# EAGLE design Tomo SMT (EAGLE 6.2)
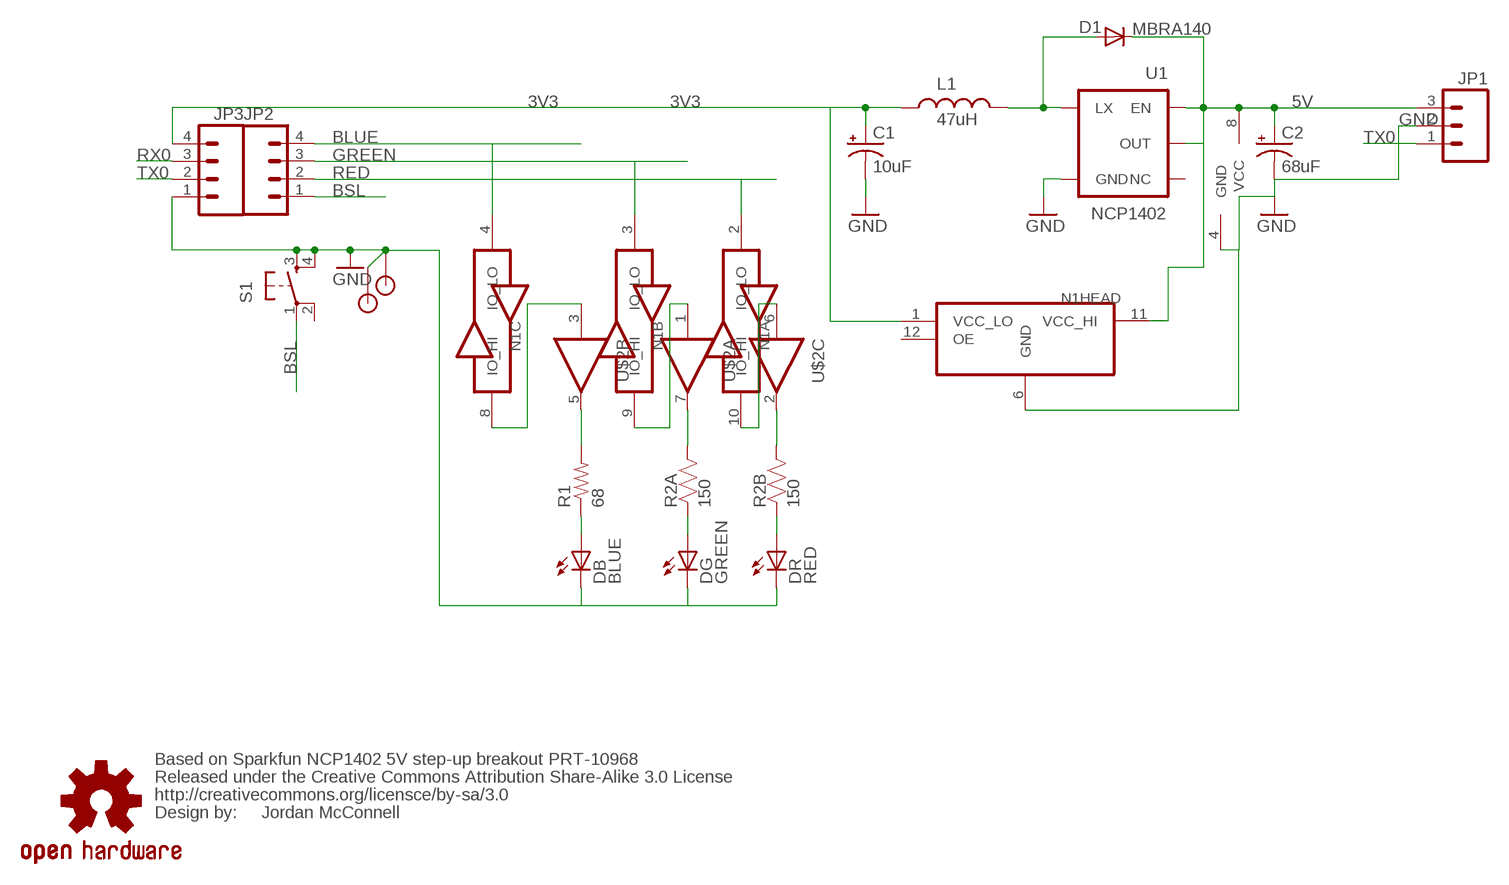
[diagram p0: schematic, sheet 1]

## Parts
C1  10uF  CAP_POL1206  [EIA3216]
C2  68uF  CAP_POL3528  [EIA3528]
D1  MBRA140  DIODESMA  [SMA-DIODE]
DB  BLUE  LED5MM  [LED5MM]
DG  GREEN  LED5MM  [LED5MM]
DR  RED  LED5MM  [LED5MM]
JP1  M03PTH  [1X03]
JP2  M04PTH  [1X04]
JP3  M04PTH  [1X04]
L1  47uH  INDUCTORRCH-895  [RADIAL_5MM]
N1  TXB0104RUT  [R-PUQFN-N12]
R1  68  RESISTOR0402-RES  [0402-RES]
R2  150  RP2EXB24V  [CRA02]
S1  TAC_SWITCHPTH  [TACTILE-PTH]
U1  NCP1402  V_REG_NCP1400SOT23-5  [SOT23-5]
U$1  OSHW-LOGOL  [OSHW-LOGO-L]
U$2  743G34  [DCT]
U$3  STANDOFF  [STANDOFF]
U$4  STANDOFF  [STANDOFF]

## Nets
3V3: C1.A(+) JP3.4 L1.1 N1.1(HEAD:VCC_LO)
5V: C2.A(+) D1.C JP1.3 N1.11(HEAD:VCC_HI) U1.1(EN) U1.2(OUT) U$2.8(VCC)
BLUE: JP2.4 N1.4(C:IO_LO)
BSL: JP2.1 S1.1
GND: C1.C(-) C2.C(-) DB.K(C) DG.K(C) DR.K(C) JP1.2 JP3.1 N1.6(HEAD:GND) S1.3 S1.4 U1.4(GND) U$2.4(GND) U$3.P$1 U$4.P$1
GREEN: JP2.3 N1.3(B:IO_LO)
N$1: R1.2 U$2.5(B:OUT)
N$2: DB.A R1.1
N$3: D1.A L1.2 U1.5(LX)
N$4: DG.A R2.1
N$5: R2.4 U$2.7(A:OUT)
N$6: R2.3 U$2.2(C:OUT)
N$7: DR.A R2.2
N$8: N1.8(C:IO_HI) U$2.3(B:IN)
N$9: N1.9(B:IO_HI) U$2.1(A:IN)
N$10: N1.10(A:IO_HI) U$2.6(C:IN)
RED: JP2.2 N1.2(A:IO_LO)
RX0: JP3.3
TX0: JP1.1 JP3.2
Unconnected: N1.5(D:IO_LO) N1.7(D:IO_HI) N1.12(HEAD:OE) S1.2 U1.3(NC)

## Notes on the sheet
- Based on Sparkfun NCP1402 5V step-up breakout PRT-10968
- Released under the Creative Commons Attribution Share-Alike 3.0 License
- http://creativecommons.org/licensce/by-sa/3.0
- Design by: | Jordan McConnell

## Library data of the parts
C1 C2 = SparkFun:CAP_POL: Capacitor Polarized These are standard SMD and PTH capacitors. Normally 10uF, 47uF, and 100uF in electrolytic and tantalum varieties. Always verify the external diameter of the through hole cap, it varies with capacity, voltage, and manufacturer. The EIA devices should be standard.
D1 = SparkFun:DIODE: Diode These are standard reverse protection diodes and small signal diodes. SMA package can handle up to about 1A. SOD-323 can handle about 200mA. What the SOD-323 package when ordering, there are some mfgs out there that are 5-pin packages.
DB DG DR = SparkFun-LED:LED: LEDs Standard schematic elements and footprints for 5mm, 3mm, 1206, and 0603 sized LEDs. 5mm - Spark Fun Electronics SKU : COM-00529 (and others)
JP1 = SparkFun-Connectors:M03: Header 3 Standard 3-pin 0.1" header. Use with straight break away headers (SKU : PRT-00116), right angle break away headers (PRT-00553), swiss pins (PRT-00743), machine pins (PRT-00117), and female headers (PRT-00115). Molex polarized connector foot print use with SKU : PRT-08232 with associated crimp pins and housings.
JP2 JP3 = SparkFun-Connectors:M04: Header 4 Standard 4-pin 0.1" header. Use with straight break away headers (SKU : PRT-00116), right angle break away headers (PRT-00553), swiss pins (PRT-00743), machine pins (PRT-00117), and female headers (PRT-00115). Molex polarized connector foot print use with SKU : PRT-08231 with associated crimp pins and housings. 1MM SMD Version SKU: PRT-10208
L1 = KwanSystems:INDUCTOR
N1 = KwanSystems:TXB0104
R1 = SparkFun-Passives:RESISTOR: Resistor Basic schematic elements and footprints for 0603, 1206, and PTH resistors.
R2 = KwanSystems:RP2
S1 = SparkFun-Electromechanical:TAC_SWITCH: Momentary Switch Button commonly used for reset or general input. Spark Fun Electronics SKU : COM-00097 SMT- SWCH-08247
U1 = SparkFun:V_REG_NCP1400: Switching step-up voltage regulator NCP1400 switiching regulator takes single cell AA and outputs 100mA at 3.3V or 5V with minimal number of external components.
U$1 = SparkFun-Aesthetics:OSHW-LOGO: Open Source Hardware Logo This logo indicates the piece of hardware it is found on incorporates a OSHW license and/or adheres to the definition of open source hardware found here: http://freedomdefined.org/OSHW
U$2 = KwanSystems:743G34
U$3 U$4 = KwanSystems:STANDOFF

## Net classes
0 default: width 0.152 mm, drill 0.33 mm, clearance 0.152 mm

## Board
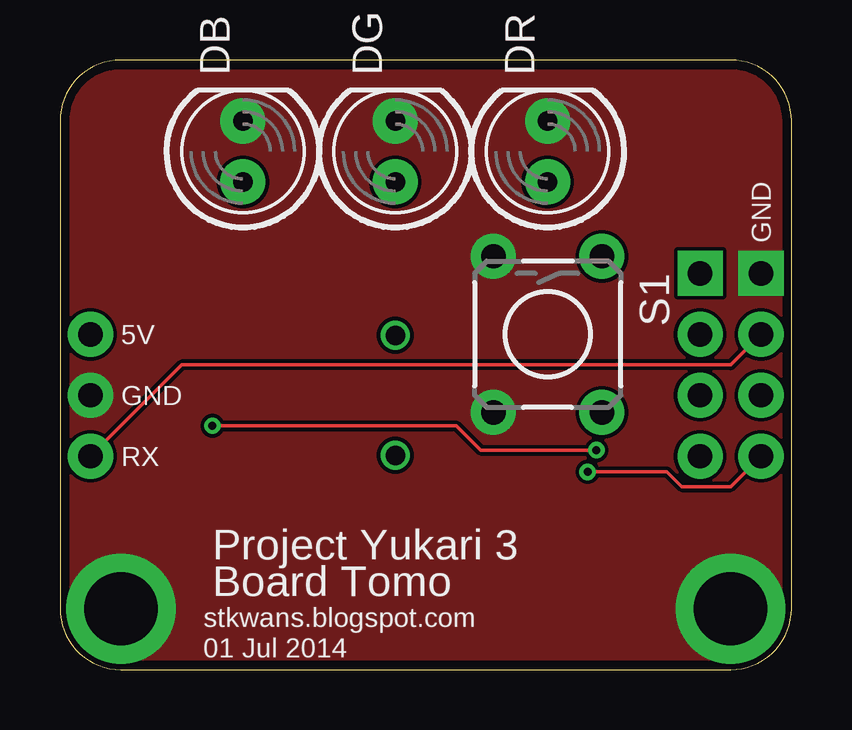
[diagram p1: board, top side]
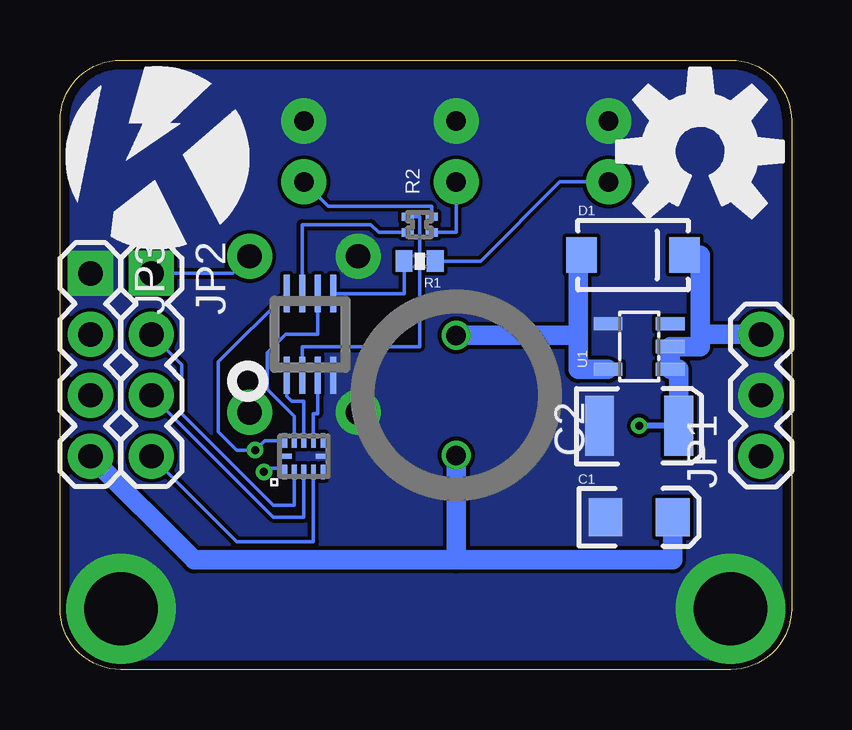
[diagram p2: board, bottom side, seen from below]

Size 30.48 x 25.4 mm. Coordinates in mm from the lower left corner, seen from the top.
Outline: 30.48,2.54 30.48,22.86 arc90 27.94,25.4 2.54,25.4 arc90 0,22.86 0,2.54 arc90 2.54,0 27.94,0 arc90 30.48,2.54
Copper layers (1*16): Top 0.0356mm / dielectric 1.5011mm / Bottom 0.0356mm
Design rules: minimum track width 6mil, minimum drill 13mil, track to track 6mil, track to pad 6mil, pad to pad 6mil, via to via 6mil, smd to smd 6mil, copper to edge 15mil, drill to drill 6mil, minimum pad ring 7mil, minimum via ring 7mil, stop-mask expansion 4mil, vias tented up to drill 0mil, thermal gap 10mil

### Footprints (pad centres in the part's own frame; a part is rotated, then mirrored left to right if it is on the bottom)
EIA3216 = smd 1.4 x 1.6: A 1.4,0; C -1.4,0
EIA3528 = smd 1.2 x 2.5: A 1.65,0; C -1.65,0
SMA-DIODE = smd 1.27 x 1.47: A -2.15,0; C 2.15,0
LED5MM = drill 0.813 pad 1.88: A -1.27,0; K 1.27,0
1X03 = drill 1.016 pad 1.88: 1 0,0; 2 2.54,0; 3 5.08,0
1X04 = drill 1.016 pad 1.88 square: 1 0,0 | drill 1.016 pad 1.88: 2 2.54,0; 3 5.08,0; 4 7.62,0
RADIAL_5MM = drill 0.813: 1 0,-2.5; 2 0,2.5
R-PUQFN-N12 = smd 0.2 x 0.6: 1 -0.8,-0.65; 2 -0.4,-0.65; 3 0,-0.65; 4 0.4,-0.65; 5 0.8,-0.65; 7 0.8,0.65; 8 0.4,0.65; 9 0,0.65; 10 -0.4,0.65; 11 -0.8,0.65 | smd 0.6 x 0.2: 6 0.8,0; 12 -0.8,0
0402-RES = smd 0.7 x 0.9: 1 -0.65,0; 2 0.65,0
CRA02 = smd 0.35 x 0.5: 1 -0.325,-0.5; 2 0.325,-0.5; 3 0.325,0.5; 4 -0.325,0.5
TACTILE-PTH = drill 1.016 pad 1.88: 1 -3.251,2.261; 2 3.251,2.261; 3 -3.251,-2.261; 4 3.251,-2.261
SOT23-5 = smd 0.55 x 1.2: 1 -0.95,-1.3; 2 0,-1.3; 3 0.95,-1.3; 4 0.95,1.3; 5 -0.95,1.3
DCT = smd 0.25 x 1.55: 1 -0.975,-1.7; 2 -0.325,-1.7; 3 0.325,-1.7; 4 0.975,-1.7; 5 0.975,1.7; 6 0.325,1.7; 7 -0.325,1.7; 8 -0.975,1.7
STANDOFF = drill 3.048 pad 4.572: P$1 0,0

### Placement (x,y rotation side)
C1  6.35,6.35 0 bottom
C2  6.35,10.16 0 bottom
D1  6.6,17.27 0 bottom
DB  7.62,21.59 90 top
DG  13.97,21.59 90 top
DR  20.32,21.59 90 top
JP1  1.27,8.89 90 bottom
JP2  26.67,16.51 270 bottom
JP3  29.21,16.51 270 bottom
L1  13.97,11.43 0 bottom
N1  20.32,8.89 0 bottom
R1  15.49,17.02 180 bottom
R2  15.49,18.54 90 bottom
S1  20.32,13.97 270 top
U1  6.35,13.46 90 bottom
U$1  3.81,21.59 0 bottom
U$2  20.07,13.97 0 bottom
U$3  27.94,2.54 90 top
U$4  2.54,2.54 90 top
U$7  [KWAN_CIRCLE]  26.42,21.34 0 bottom

### Tracks (layer width: path | path; a pad name or v marks a point on that pad's centre or on a via)
3V3  (via drill 0.33)
  Top 0.152: v21.99,8.24 25.29,8.24 25.91,7.62 27.94,7.62 JP3.4
  Bottom 0.152: N1.1 21.19,8.24 21.34,8.38 21.84,8.38 v21.99,8.24
  Bottom 0.813: C1.A 4.95,4.57 13.97,4.57 | L1.1 13.97,4.57 | 13.97,4.57 24.89,4.57 JP3.4
5V  (via drill 0.33)
  Top 0.152: v6.35,10.16 16.51,10.16 17.53,9.14 v22.35,9.14
  Bottom 0.152: N1.11 21.96,9.54 v22.35,9.14 23.11,9.14 23.88,9.91 23.88,12.84 U$2.8 | 3.81,13.46 3.3,13.97
  Bottom 0.254: 3.81,17.27 D1.C | C2.A v6.35,10.16
  Bottom 0.813: 3.81,17.27 3.81,13.46 U1.2 U1.1 4.7,12.51 C2.A 4.7,11.43 | 3.3,13.97 JP1.3
BLUE
  Bottom 0.152: JP2.4 23.11,5.33 19.92,5.33 N1.4
BSL
  Bottom 0.152: JP2.1 23.29,16.51 S1.1
GND
  pour Top (no thermals): 30.48,0 30.48,25.4 0,25.4 0,0
  pour Bottom (no thermals): 30.48,0 30.48,25.4 0,25.4 0,0
GREEN
  Bottom 0.152: JP2.3 21.59,6.35 20.32,6.35 N1.3
N$1
  Bottom 0.152: U$2.5 16.14,15.67 R1.2
N$2
  Bottom 0.152: R1.1 12.95,17.02 9.65,20.32 DB.A
N$3
  Bottom 0.254: 8.89,17.27 D1.A arc90 8.85,17.37
  Bottom 0.813: U1.5 8.89,12.51 8.89,13.93 | 8.89,13.93 8.89,17.27 | L1.2 8.89,13.93
N$4
  Bottom 0.152: R2.1 13.97,18.22 DG.A
N$5
  Bottom 0.152: U$2.7 20.39,18.54 17.53,18.54 17.2,18.22 R2.4
N$6
  Bottom 0.152: U$2.2 20.39,13.46 15.49,13.46 15.49,18.87 R2.3
N$7
  Bottom 0.152: R2.2 14.99,19.3 19.3,19.3 DR.A
N$8
  Bottom 0.152: N1.8 19.92,10.67 19.74,10.67 U$2.3
N$9
  Bottom 0.152: N1.9 20.32,11.18 20.83,11.18 21.04,11.39 U$2.1
N$10
  Bottom 0.152: N1.10 20.72,10.56 21.84,11.68 21.84,13.21 21.08,13.97 19.74,13.97 U$2.6
RED
  Bottom 0.152: JP2.2 25.4,12.7 25.4,10.67 21.59,6.86 20.72,6.86 N1.2
TX0
  Top 0.152: JP3.2 27.94,12.7 5.08,12.7 JP1.1

### Text on the board
tPlace: GND | 5V | GND | RX | Project Yukari 3 | Board Tomo | stkwans.blogspot.com | 01 Jul 2014